# Altium project FIoT_BG96.PrjPcb
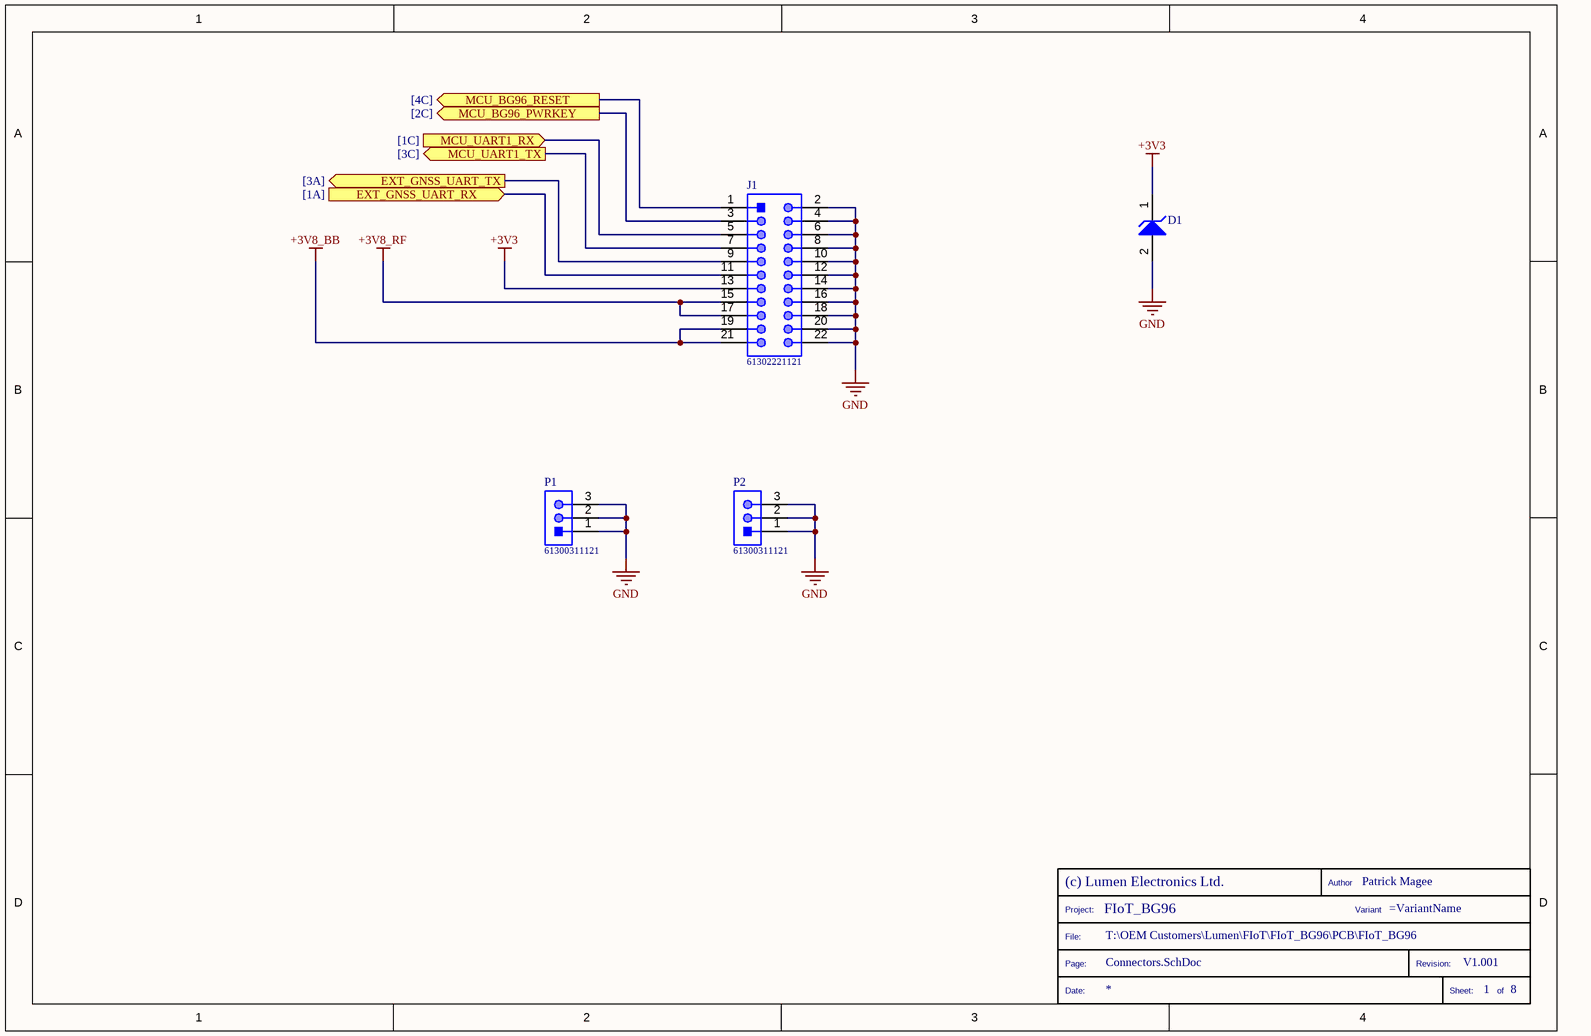
[diagram p0: Connectors.SchDoc]
VersionRevision: V1.001; ProjectAuthor: Patrick Magee; Project: FIoT_BG96; FilePath: T:\OEM Customers\Lumen\FIoT\FIoT_BG96\PCB\FIoT_BG96; Company: (c) Lumen Electronics Ltd.
8 sheets, 76 parts. Net scope: flat (ports and power ports of the same name join across sheets).
Board file: FIoT_BG96.PcbDoc
Sheets:
  Connectors.SchDoc
  UART_Level_Shift.SchDoc
  BG96.SchDoc
  Debug_USB.SchDoc
  Power.SchDoc
  MMF2.SchDoc
  Interface.SchDoc
  Status_Net_LEDs.SchDoc

## Sheet Connectors.SchDoc: FIoT Rev 2.0
size A4; ApprovedBy: Patrick Magee; CheckedBy: Patrick Magee; Author: Patrick Magee; DrawnBy: Patrick Magee; Engineer: Patrick Magee; Organization: Lumen Electronics; DocumentNumber: 18072022 - 1; Revision: 0; SheetNumber: 1; SheetTotal: 8; ENG_APP_DATE: --/--/--; DSN_APP_DATE: --/--/--; CHK_APP_DATE: --/--/--; REV: 1.1

### Parts
*  TitleBlock  (value not drawn)  (graphical)
D1  ESD9X3.3ST5G  [ONSC-SOD-923-2-514AA-01_V]  (value not drawn)
J1  61302221121  [61302221121]
P1  61300311121  [61300311121]
P2  61300311121  [61300311121]

### Ports
EXT_GNSS_UART_RX (in, see [1A]), EXT_GNSS_UART_TX (out, see [3A]), MCU_BG96_PWRKEY (out, see [2C]), MCU_BG96_RESET (out, see [4C]), MCU_UART1_RX (in, see [1C]), MCU_UART1_TX (out, see [3C])

### Nets
+3V3: D1.1(K) J1.13
+3V8_BB: J1.19 J1.21
+3V8_RF: J1.15 J1.17
GND: D1.2(A) J1.2 J1.4 J1.6 J1.8 J1.10 J1.12 J1.14 J1.16 J1.18 J1.20 J1.22 P1.1 P1.2 P1.3 P2.1 P2.2 P2.3
EXT_GNSS_UART_RX: J1.11 ; port EXT_GNSS_UART_RX
EXT_GNSS_UART_TX: J1.9 ; port EXT_GNSS_UART_TX
MCU_BG96_PWRKEY: J1.3 ; port MCU_BG96_PWRKEY
MCU_BG96_RESET: J1.1 ; port MCU_BG96_RESET
MCU_UART1_RX: J1.5 ; port MCU_UART1_RX
MCU_UART1_TX: J1.7 ; port MCU_UART1_TX

### Notes on the sheet
- DWG. NO.
- REV.
- SHT.
- THIS DOCUMENT AND THE DATA DISCLOSED HEREIN OR HEREWITH IS THE PROPERTY OF ALTIUM LIMITED AND MAY BE FREELY DISTRIBUTED IN WHOLE. NO RIGHTS ARE RESERVED OR EXPRESS OR IMPLIED WARANTEE GIVEN.
- REVISION
- DESCRIPTION
- DATE
- APPROVED
- ENG:
- APPROVALS
- PROJECT
- DSN:
- CHK:
- REFERENCE DOCUMENTS
- PROJECT REVISION:
- TITLE
- DOCUMENT REVISION:
- DESIGN ITEM:
- BOM:
- FAB DWG:
- PCB DWG:
- ASSY DWG:
- SCALE:
- SIZE
- B
- CAGE CODE
- FILE NAME
- DWG NO.
- SHEET
- OF
- REV
- (in symbol TitleBlock) Author; Project:; Variant; File:; Page:; Revision:; Date:; Sheet:; of

### Library data of the parts
D1 = LPN00013: Transient Voltage Suppressor, Micro-Packaged Diode for ESD Protection, 2-Pin SOD-923, Pb-Free, Tape and Reel; Manufacturer 1: On Semiconductor; Manufacturer Part Number 1: ESD9X3.3ST5G; Supplier 1: Farnell; Supplier Part Number 1: 2627963; Lumen Part Number: LPN00013
J1 = LPN00011: THT Vertical Pin Header WR-PHD, Pitch 2.54 mm, Dual Row, 22 pins; Manufacturer 1: Wurth Elektronik; Manufacturer Part Number 1: 61302221121; Lumen Part Number: LPN00011
P1 P2 = LPN00010: THT Vertical Pin Header WR-PHD, Pitch 2.54 mm, Single Row, 3 pins; Manufacturer 1: Wurth Elektronik; Manufacturer Part Number 1: 61300311121; Lumen Part Number: LPN00010

## Sheet UART_Level_Shift.SchDoc: FIoT Rev 2.0
size A4; ApprovedBy: PM; CheckedBy: PM; Author: PM; CompanyName: -; DrawnBy: PM; Engineer: AG; DocumentNumber: 18072022 - 1; Revision: 0; SheetNumber: 2; SheetTotal: 8; CHK_APP_DATE: --/--/--
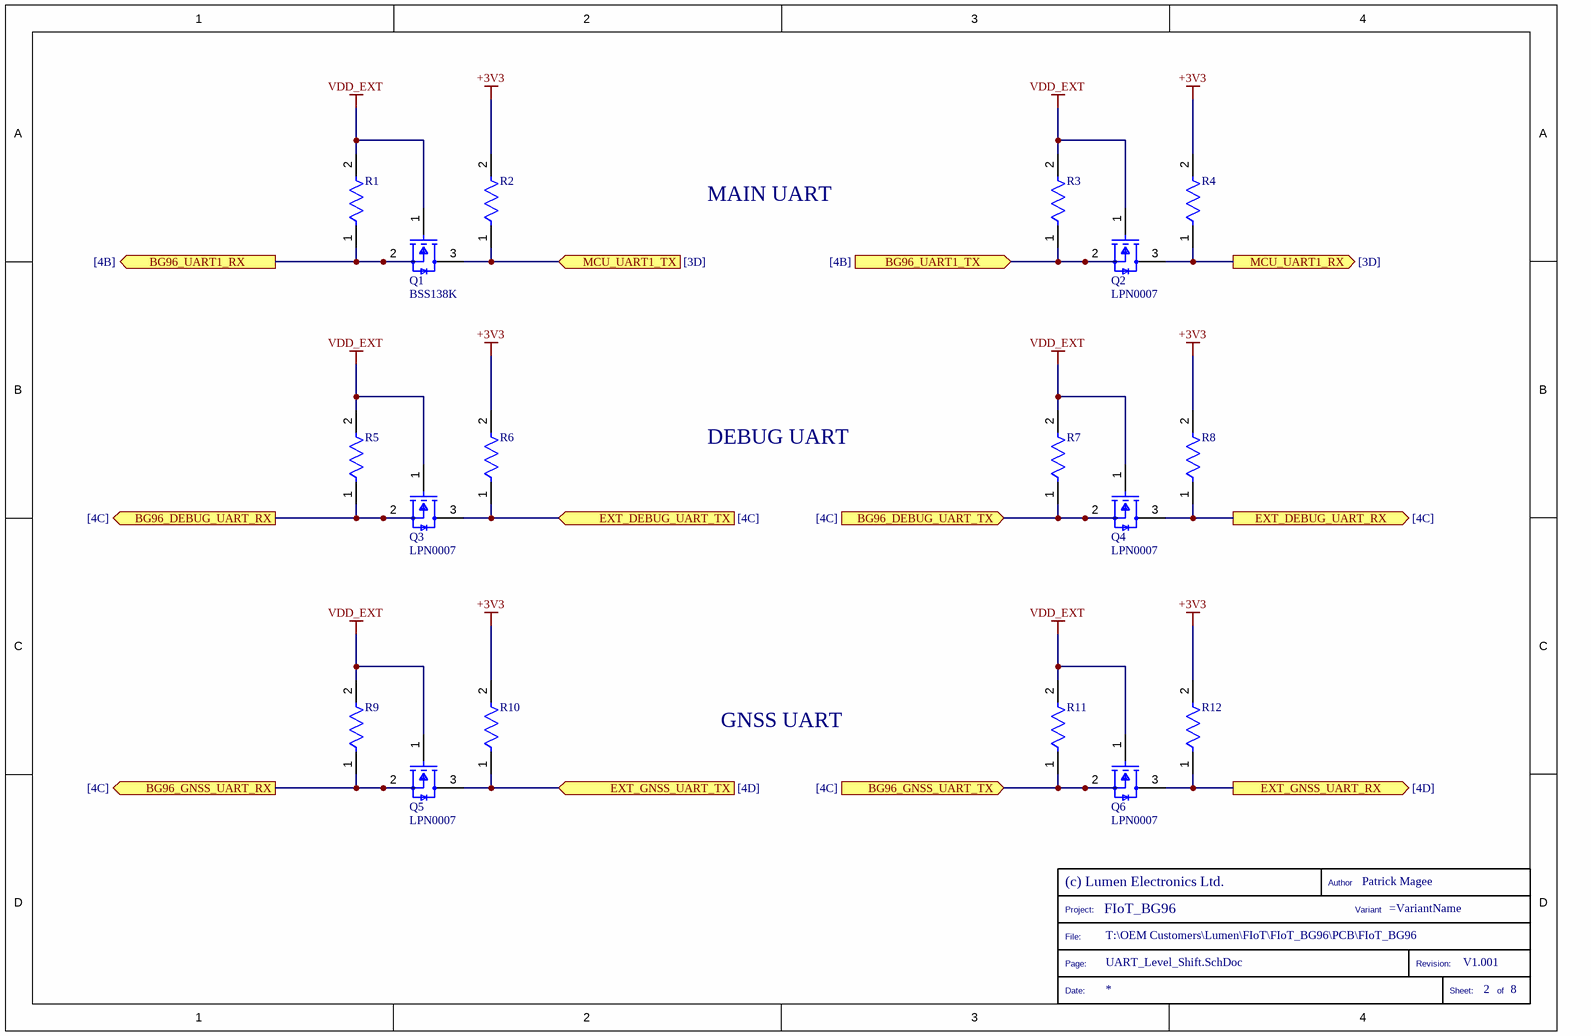
[diagram p1: UART_Level_Shift.SchDoc]

### Parts
(Parts that share a designator on the sheet are numbered #1, #2 ... from top to bottom, then left to right.)
*?#1  TitleBlock  (value not drawn)  (graphical)
Q1  BSS138K  [FP-318-08-IPC_B]
Q2  LPN0007  [FP-318-08-IPC_B]
Q3  LPN0007  [FP-318-08-IPC_B]
Q4  LPN0007  [FP-318-08-IPC_B]
Q5  LPN0007  [FP-318-08-IPC_B]
Q6  LPN0007  [FP-318-08-IPC_B]
R1  0402WGF1002TCE  [FP-CRCW0402-e3-MFG]  (value not drawn)
R2  0402WGF1002TCE  [FP-CRCW0402-e3-MFG]  (value not drawn)
R3  0402WGF1002TCE  [FP-CRCW0402-e3-MFG]  (value not drawn)
R4  0402WGF1002TCE  [FP-CRCW0402-e3-MFG]  (value not drawn)
R5  0402WGF1002TCE  [FP-CRCW0402-e3-MFG]  (value not drawn)
R6  0402WGF1002TCE  [FP-CRCW0402-e3-MFG]  (value not drawn)
R7  0402WGF1002TCE  [FP-CRCW0402-e3-MFG]  (value not drawn)
R8  0402WGF1002TCE  [FP-CRCW0402-e3-MFG]  (value not drawn)
R9  0402WGF1002TCE  [FP-CRCW0402-e3-MFG]  (value not drawn)
R10  0402WGF1002TCE  [FP-CRCW0402-e3-MFG]  (value not drawn)
R11  0402WGF1002TCE  [FP-CRCW0402-e3-MFG]  (value not drawn)
R12  0402WGF1002TCE  [FP-CRCW0402-e3-MFG]  (value not drawn)

### Ports
BG96_DEBUG_UART_RX (out, see [4C]), BG96_DEBUG_UART_TX (in, see [4C]), BG96_GNSS_UART_RX (out, see [4C]), BG96_GNSS_UART_TX (in, see [4C]), BG96_UART1_RX (out, see [4B]), BG96_UART1_TX (in, see [4B]), EXT_DEBUG_UART_RX (out, see [4C]), EXT_DEBUG_UART_TX (in, see [4C]), EXT_GNSS_UART_RX (out, see [4D]), EXT_GNSS_UART_TX (in, see [4D]), MCU_UART1_RX (out, see [3D]), MCU_UART1_TX (in, see [3D])

### Nets
+3V3: R2.2 R4.2 R6.2 R8.2 R10.2 R12.2
VDD_EXT: Q1.1(G) Q2.1(G) Q3.1(G) Q4.1(G) Q5.1(G) Q6.1(G) R1.2 R3.2 R5.2 R7.2 R9.2 R11.2
BG96_DEBUG_UART_RX: Q3.2(S) R5.1 ; port BG96_DEBUG_UART_RX
BG96_DEBUG_UART_TX: Q4.2(S) R7.1 ; port BG96_DEBUG_UART_TX
BG96_GNSS_UART_RX: Q5.2(S) R9.1 ; port BG96_GNSS_UART_RX
BG96_GNSS_UART_TX: Q6.2(S) R11.1 ; port BG96_GNSS_UART_TX
BG96_UART1_RX: Q1.2(S) R1.1 ; port BG96_UART1_RX
BG96_UART1_TX: Q2.2(S) R3.1 ; port BG96_UART1_TX
EXT_DEBUG_UART_RX: Q4.3(D) R8.1 ; port EXT_DEBUG_UART_RX
EXT_DEBUG_UART_TX: Q3.3(D) R6.1 ; port EXT_DEBUG_UART_TX
EXT_GNSS_UART_RX: Q6.3(D) R12.1 ; port EXT_GNSS_UART_RX
EXT_GNSS_UART_TX: Q5.3(D) R10.1 ; port EXT_GNSS_UART_TX
MCU_UART1_RX: Q2.3(D) R4.1 ; port MCU_UART1_RX
MCU_UART1_TX: Q1.3(D) R2.1 ; port MCU_UART1_TX

### Notes on the sheet
- MAIN UART
- DEBUG UART
- GNSS UART
- DWG. NO.
- REV.
- SHT.
- THIS DOCUMENT AND THE DATA DISCLOSED HEREIN OR HEREWITH IS THE PROPERTY OF ALTIUM LIMITED AND MAY BE FREELY DISTRIBUTED IN WHOLE. NO RIGHTS ARE RESERVED OR EXPRESS OR IMPLIED WARANTEE GIVEN.
- REVISION
- DESCRIPTION
- DATE
- APPROVED
- ENG:
- APPROVALS
- PROJECT
- DSN:
- CHK:
- REFERENCE DOCUMENTS
- PROJECT REVISION:
- TITLE
- DOCUMENT REVISION:
- DESIGN ITEM:
- BOM:
- FAB DWG:
- PCB DWG:
- ASSY DWG:
- SCALE:
- SIZE
- B
- CAGE CODE
- FILE NAME
- DWG NO.
- SHEET
- OF
- REV
- (in symbol TitleBlock) Author; Project:; Variant; File:; Page:; Revision:; Date:; Sheet:; of

### Library data of the parts
Q1-Q6 = LPN0007: MOSFET N-CH 50V 220MA SOT-23; Manufacturer 1: ON Semiconductor / Fairchild; Manufacturer Part Number 1: BSS138; Supplier 1: Digi-Key; Supplier Part Number 1: BSS138K-13DICT-ND; Lumen Part Number: LPN0007
R1-R12 = LPN0003: Res Thick Film 0402 10K Ohm 1% 0.063W; Manufacturer 1: Vishay Dale; Manufacturer Part Number 1: CRCW04021K00FKED; Supplier 1: Mouser; Supplier Part Number 1: 303-0402WGF1002TCE; Lumen Part Number: LPN0003

## Sheet BG96.SchDoc: FIoT Rev 2.0
size A4; ApprovedBy: PM; CheckedBy: PM; Author: AG; CompanyName: -; DrawnBy: AG; Engineer: AG; DocumentNumber: 18072022 - 1; Revision: 0; SheetNumber: 3; SheetTotal: 8; ENG_APP_DATE: --/--/--; DSN_APP_DATE: --/--/--; CHK_APP_DATE: --/--/--
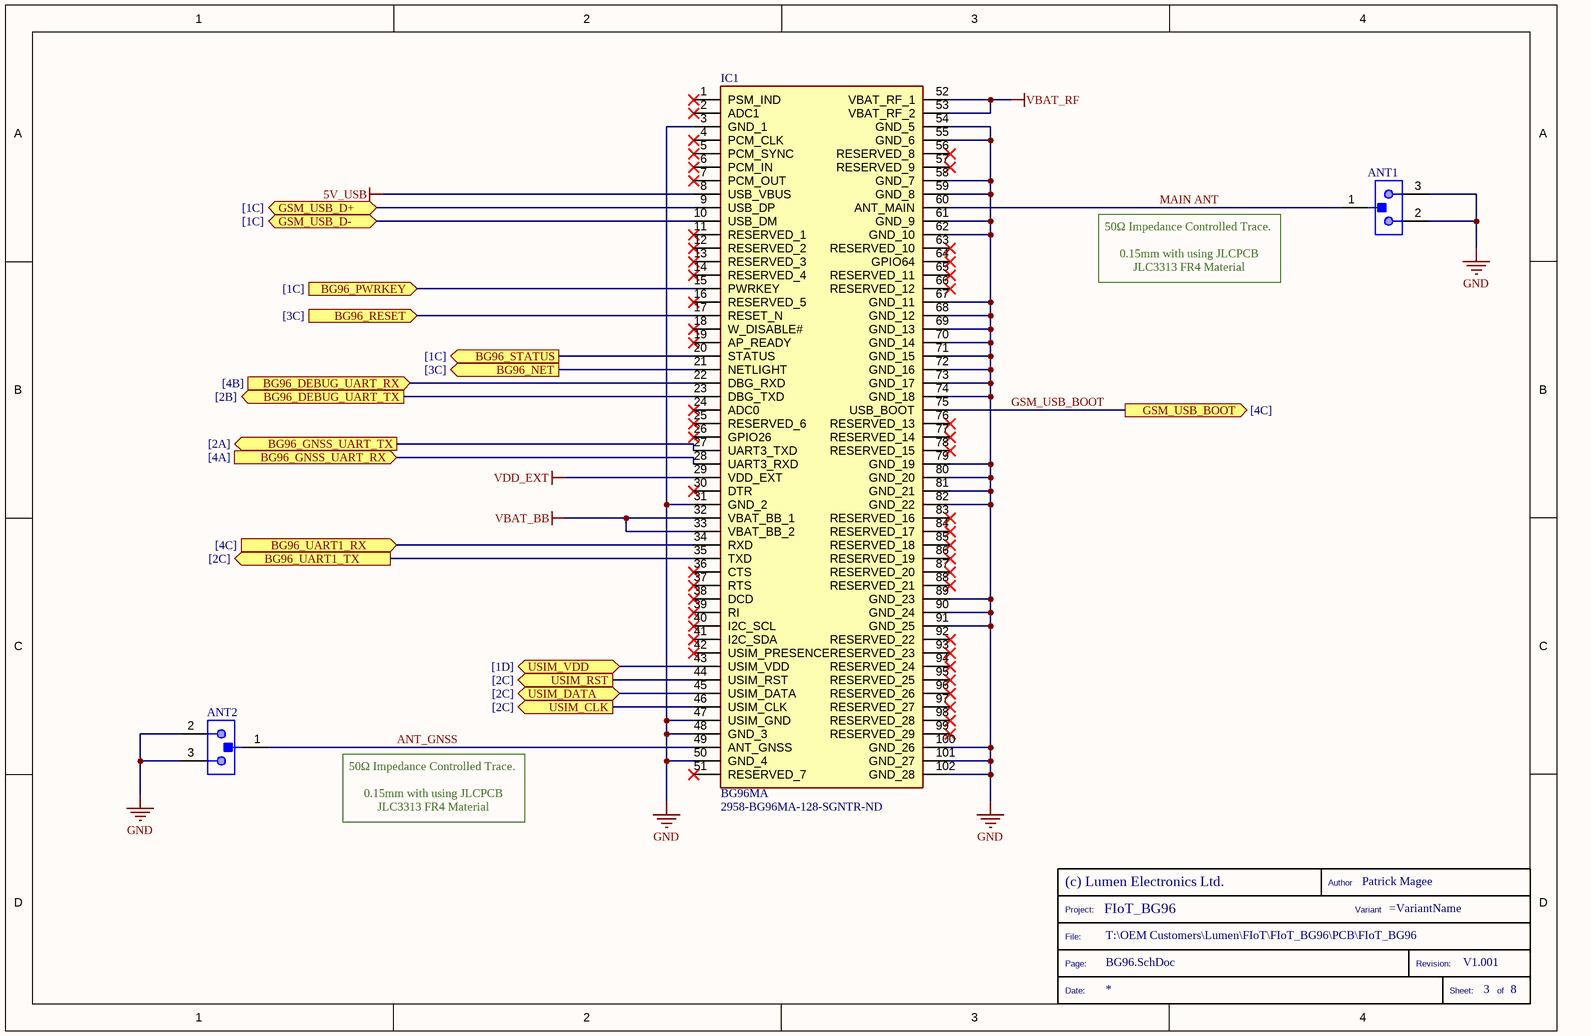
[diagram p2: BG96.SchDoc]

### Parts
(Parts that share a designator on the sheet are numbered #1, #2 ... from top to bottom, then left to right.)
*?#2  TitleBlock  (value not drawn)  (graphical)
ANT1  U.FL-R-SMT(01)  [HRS-U.FL-R-SMT(10)_V]  (value not drawn)
ANT2  U.FL-R-SMT(01)  [HRS-U.FL-R-SMT(10)_V]  (value not drawn)
IC1  BG96MA  Supplier Part Number 1: 2958-BG96MA-128-SGNTR-ND  [BG96MA]

### Ports
BG96_DEBUG_UART_RX (in, see [4B]), BG96_DEBUG_UART_TX (out, see [2B]), BG96_GNSS_UART_RX (in, see [4A]), BG96_GNSS_UART_TX (out, see [2A]), BG96_NET (out, see [3C]), BG96_PWRKEY (in, see [1C]), BG96_RESET (in, see [3C]), BG96_STATUS (out, see [1C]), BG96_UART1_RX (in, see [4C]), BG96_UART1_TX (out, see [2C]), GSM_USB_BOOT (out, see [4C]), GSM_USB_D+ (bidir, see [1C]), GSM_USB_D- (bidir, see [1C]), USIM_CLK (out, see [2C]), USIM_DATA (bidir, see [2C]), USIM_RST (out, see [2C]), USIM_VDD (bidir, see [1D])

### Nets
5V_USB: IC1.8(USB_VBUS)
GND: ANT1.2 ANT1.3 ANT2.2 ANT2.3 IC1.3(GND_1) IC1.31(GND_2) IC1.47(USIM_GND) IC1.48(GND_3) IC1.50(GND_4) IC1.54(GND_5) IC1.55(GND_6) IC1.58(GND_7) IC1.59(GND_8) IC1.61(GND_9) IC1.62(GND_10) IC1.67(GND_11) IC1.68(GND_12) IC1.69(GND_13) IC1.70(GND_14) IC1.71(GND_15) IC1.72(GND_16) IC1.73(GND_17) IC1.74(GND_18) IC1.79(GND_19) IC1.80(GND_20) IC1.81(GND_21) IC1.82(GND_22) IC1.89(GND_23) IC1.90(GND_24) IC1.91(GND_25) IC1.100(GND_26) IC1.101(GND_27) IC1.102(GND_28)
VBAT_BB: IC1.32(VBAT_BB_1) IC1.33(VBAT_BB_2)  [project net +3V8_BB]
VBAT_RF: IC1.52(VBAT_RF_1) IC1.53(VBAT_RF_2)  [project net +3V8_RF]
VDD_EXT: IC1.29(VDD_EXT)
ANT_GNSS: ANT2.1 IC1.49(ANT_GNSS)
BG96_DEBUG_UART_RX: IC1.22(DBG_RXD) ; port BG96_DEBUG_UART_RX
BG96_DEBUG_UART_TX: IC1.23(DBG_TXD) ; port BG96_DEBUG_UART_TX
BG96_GNSS_UART_RX: IC1.28(UART3_RXD) ; port BG96_GNSS_UART_RX
BG96_GNSS_UART_TX: IC1.27(UART3_TXD) ; port BG96_GNSS_UART_TX
BG96_NET: IC1.21(NETLIGHT) ; port BG96_NET
BG96_PWRKEY: IC1.15(PWRKEY) ; port BG96_PWRKEY
BG96_RESET: IC1.17(RESET_N) ; port BG96_RESET
BG96_STATUS: IC1.20(STATUS) ; port BG96_STATUS
BG96_UART1_RX: IC1.34(RXD) ; port BG96_UART1_RX
BG96_UART1_TX: IC1.35(TXD) ; port BG96_UART1_TX
GSM_USB_BOOT: IC1.75(USB_BOOT) ; port GSM_USB_BOOT
GSM_USB_D+: IC1.9(USB_DP) ; port GSM_USB_D+
GSM_USB_D-: IC1.10(USB_DM) ; port GSM_USB_D-
MAIN ANT: ANT1.1 IC1.60(ANT_MAIN)
USIM_CLK: IC1.46(USIM_CLK) ; port USIM_CLK
USIM_DATA: IC1.45(USIM_DATA) ; port USIM_DATA
USIM_RST: IC1.44(USIM_RST) ; port USIM_RST
USIM_VDD: IC1.43(USIM_VDD) ; port USIM_VDD

Not connected (* = marked no-connect by the designer): IC1 1(PSM_IND)* 2(ADC1)* 4(PCM_CLK)* 5(PCM_SYNC)* 6(PCM_IN)* 7(PCM_OUT)* 11(RESERVED_1)* 12(RESERVED_2)* 13(RESERVED_3)* 14(RESERVED_4)* 16(RESERVED_5)* 18(W_DISABLE#)* 19(AP_READY)* 24(ADC0)* 25(RESERVED_6)* 26(GPIO26)* 30(DTR)* 36(CTS)* 37(RTS)* 38(DCD)* 39(RI)* 40(I2C_SCL)* 41(I2C_SDA)* 42(USIM_PRESENCE)* 51(RESERVED_7)* 56(RESERVED_8)* 57(RESERVED_9)* 63(RESERVED_10)* 64(GPIO64)* 65(RESERVED_11)* 66(RESERVED_12)* 76(RESERVED_13)* 77(RESERVED_14)* 78(RESERVED_15)* 83(RESERVED_16)* 84(RESERVED_17)* 85(RESERVED_18)* 86(RESERVED_19)* 87(RESERVED_20)* 88(RESERVED_21)* 92(RESERVED_22)* 93(RESERVED_23)* 94(RESERVED_24)* 95(RESERVED_25)* 96(RESERVED_26)* 97(RESERVED_27)* 98(RESERVED_28)* 99(RESERVED_29)*

### Notes on the sheet
- 50Ω Impedance Controlled Trace.
  0.15mm with using JLCPCB JLC3313 FR4 Material
- DWG. NO.
- REV.
- SHT.
- THIS DOCUMENT AND THE DATA DISCLOSED HEREIN OR HEREWITH IS THE PROPERTY OF ALTIUM LIMITED AND MAY BE FREELY DISTRIBUTED IN WHOLE. NO RIGHTS ARE RESERVED OR EXPRESS OR IMPLIED WARANTEE GIVEN.
- REVISION
- DESCRIPTION
- DATE
- APPROVED
- ENG:
- APPROVALS
- PROJECT
- DSN:
- CHK:
- REFERENCE DOCUMENTS
- PROJECT REVISION:
- TITLE
- DOCUMENT REVISION:
- DESIGN ITEM:
- BOM:
- FAB DWG:
- PCB DWG:
- ASSY DWG:
- SCALE:
- SIZE
- B
- CAGE CODE
- FILE NAME
- DWG NO.
- SHEET
- OF
- REV
- (in symbol TitleBlock) Author; Project:; Variant; File:; Page:; Revision:; Date:; Sheet:; of

### Library data of the parts
ANT1 ANT2 = LPN00021: CONN RECPT ULTRA-MINI COAX SMD; Manufacturer 1: Hirose Electric; Manufacturer Part Number 1: U.FL-R-SMT(01); Supplier 1: Farnell; Supplier Part Number 1: 3908021; Lumen Part Number: LPN00021
IC1 = LPN0006: Cellular EDGE, GPRS, GSM, HSPA, LTE, UMTS Transceiver Module 850MHz, 900MHz, 1.8GHz, 1.9GHz Antenna Not Included Surface Mount; Supplier 1: Digi-Key; Lumen Part Number: LPN0006

## Sheet Debug_USB.SchDoc: FIoT Rev 2.0
size A4; ApprovedBy: PM; CheckedBy: PM; Author: AG; CompanyName: -; DrawnBy: AG; Engineer: AG; DocumentNumber: 18072022 - 1; Revision: 0; SheetNumber: 4; SheetTotal: 8; ENG_APP_DATE: --/--/--; DSN_APP_DATE: --/--/--; CHK_APP_DATE: --/--/--
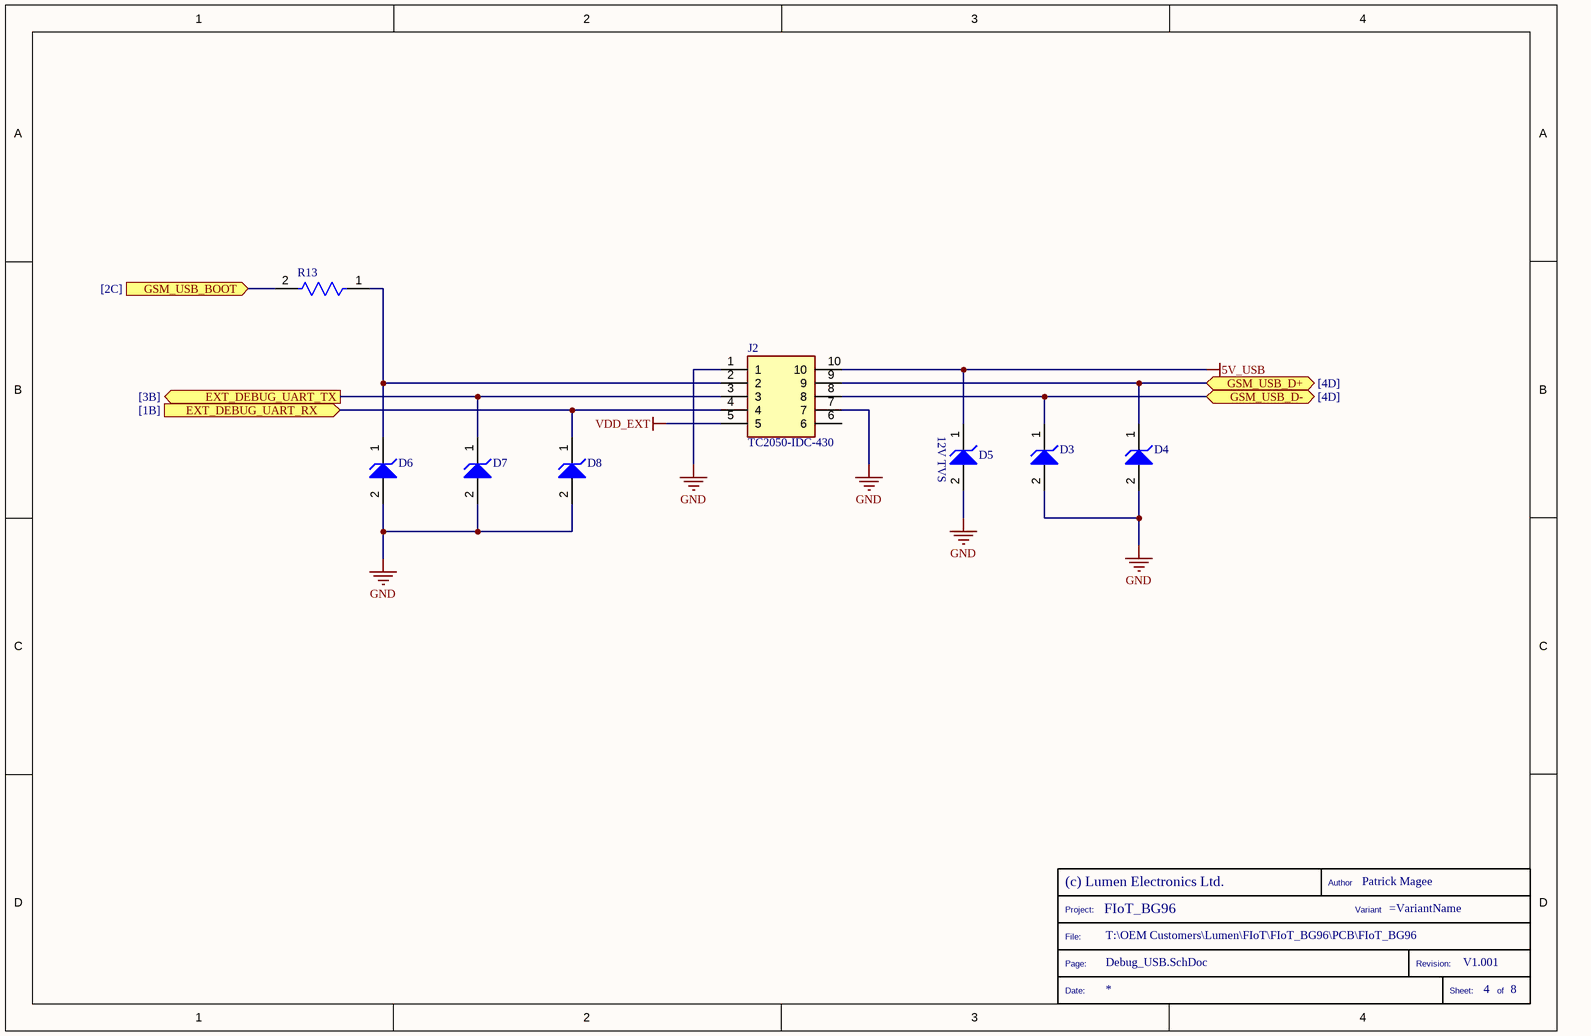
[diagram p3: Debug_USB.SchDoc]

### Parts
(Parts that share a designator on the sheet are numbered #1, #2 ... from top to bottom, then left to right.)
*?#3  TitleBlock  (value not drawn)  (graphical)
D3  ESD9L5.0ST5G  [ONSC-SOD-923-2-514AA-01_V]  (value not drawn)
D4  ESD9L5.0ST5G  [ONSC-SOD-923-2-514AA-01_V]  (value not drawn)
D5  SD12C.TCT  [CR_SD05_SEM-L]  (value not drawn)
D6  ESD9X3.3ST5G  [ONSC-SOD-923-2-514AA-01_V]  (value not drawn)
D7  ESD9X3.3ST5G  [ONSC-SOD-923-2-514AA-01_V]  (value not drawn)
D8  ESD9X3.3ST5G  [ONSC-SOD-923-2-514AA-01_V]  (value not drawn)
J2  TC2050-IDC-430  [TC2050-IDC_Lumen]  (no BOM)
R13  0402WGF1002TCE  [FP-CRCW0402-e3-MFG]  (value not drawn)

### Ports
EXT_DEBUG_UART_RX (in, see [1B]), EXT_DEBUG_UART_TX (out, see [3B]), GSM_USB_BOOT (in, see [2C]), GSM_USB_D+ (bidir, see [4D]), GSM_USB_D- (bidir, see [4D])

### Nets
5V_USB: D5.1(K) J2.10
GND: D3.2(A) D4.2(A) D5.2(A) D6.2(A) D7.2(A) D8.2(A) J2.1 J2.7
VDD_EXT: J2.5
EXT_DEBUG_UART_RX: D8.1(K) J2.4 ; port EXT_DEBUG_UART_RX
EXT_DEBUG_UART_TX: D7.1(K) J2.3 ; port EXT_DEBUG_UART_TX
GSM_USB_BOOT: R13.2 ; port GSM_USB_BOOT
GSM_USB_D+: D4.1(K) J2.9 ; port GSM_USB_D+
GSM_USB_D-: D3.1(K) J2.8 ; port GSM_USB_D-
NetD6_1: D6.1(K) J2.2 R13.1

Not connected (* = marked no-connect by the designer): J2 6

### Notes on the sheet
- DWG. NO.
- REV.
- SHT.
- THIS DOCUMENT AND THE DATA DISCLOSED HEREIN OR HEREWITH IS THE PROPERTY OF ALTIUM LIMITED AND MAY BE FREELY DISTRIBUTED IN WHOLE. NO RIGHTS ARE RESERVED OR EXPRESS OR IMPLIED WARANTEE GIVEN.
- REVISION
- DESCRIPTION
- DATE
- APPROVED
- ENG:
- APPROVALS
- PROJECT
- DSN:
- CHK:
- REFERENCE DOCUMENTS
- PROJECT REVISION:
- TITLE
- DOCUMENT REVISION:
- DESIGN ITEM:
- BOM:
- FAB DWG:
- PCB DWG:
- ASSY DWG:
- SCALE:
- SIZE
- B
- CAGE CODE
- FILE NAME
- DWG NO.
- SHEET
- OF
- REV
- (in symbol LPN00017) 12V TVS
- (in symbol TitleBlock) Author; Project:; Variant; File:; Page:; Revision:; Date:; Sheet:; of

### Library data of the parts
D3 D4 = LPN00012: Transient Voltage Suppressor, ESD Protection Diode with Ultra-Low Capacitance, 2-Pin SOD-923, Pb-Free, Tape and Reel; Manufacturer 1: ON Semiconductor; Manufacturer Part Number 1: ESD9L5.0ST5G; Supplier 1: Digi-Key; Supplier Part Number 1: ESD9L5.0ST5GOSCT-ND; Lumen Part Number: LPN00012
D5 = LPN00017: TVS DIODE 12VWM 24VC SOD323; Supplier 1: Digi-Key; Supplier Part Number 1: SD12C.TCTCT-ND; Lumen Part Number: LPN00017
D6-D8 = LPN00013: as D1 on sheet Connectors; Manufacturer Part Number 1: ESD9X3.3ST5G; Supplier 1: Farnell; Supplier Part Number 1: 2627963; Lumen Part Number: LPN00013
J2 = LPN00019: Connector; Lumen Part Number: LPN00019
R13 = LPN0003: as R1 on sheet UART_Level_Shift; Supplier 1: Mouser; Supplier Part Number 1: 303-0402WGF1002TCE; Lumen Part Number: LPN0003

## Sheet Power.SchDoc: FIoT Rev 2.0
size A4; ApprovedBy: PM; CheckedBy: PM; Author: AG; CompanyName: -; DrawnBy: AG; Engineer: AG; DocumentNumber: 18072022 - 1; Revision: 0; SheetNumber: 5; SheetTotal: 8; ENG_APP_DATE: --/--/--; DSN_APP_DATE: --/--/--; CHK_APP_DATE: --/--/--
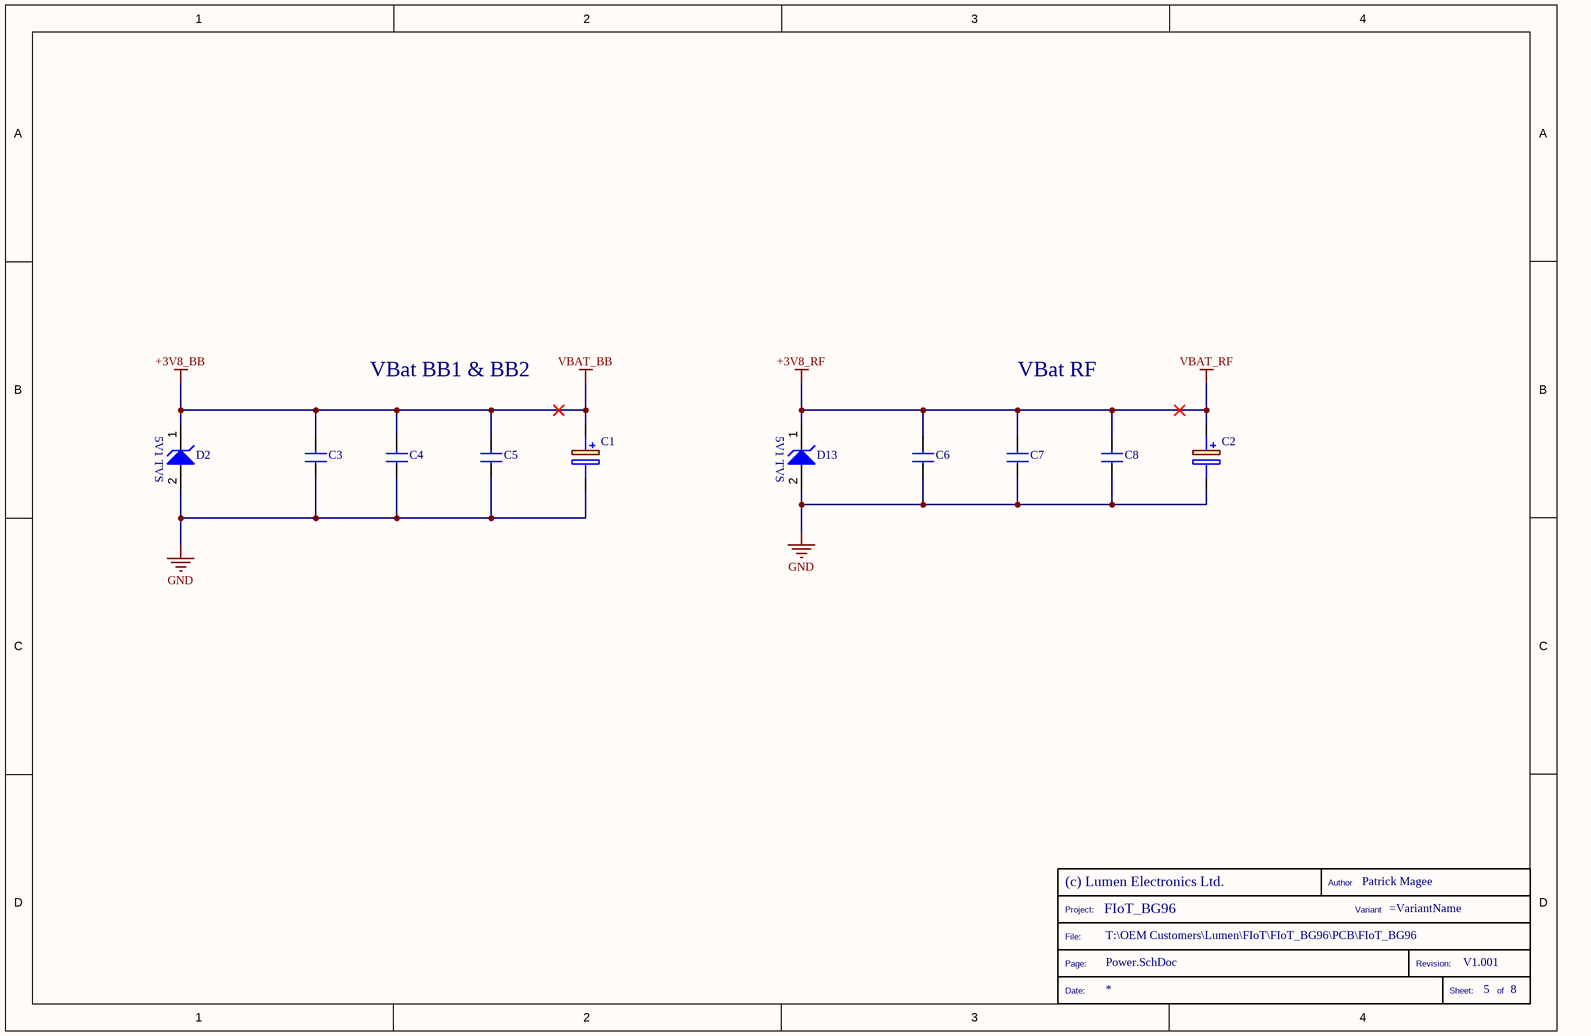
[diagram p4: Power.SchDoc]

### Parts
(Parts that share a designator on the sheet are numbered #1, #2 ... from top to bottom, then left to right.)
*?#4  TitleBlock  (value not drawn)  (graphical)
C1  T520A107M006ATE035  [CAPPM3216X180N]  (value not drawn)
C2  T520A107M006ATE035  [CAPPM3216X180N]  (value not drawn)
C3  GRM1555C1H6R0CA01D  [CAPC1005X06N]  (value not drawn)
C4  GJM1555C1H330GB01D  [CAPC1005X06N]  (value not drawn)
C5  CL05B104KB54PNC  [CAPC1005X06N]  (value not drawn)
C6  GRM1555C1H6R0CA01D  [CAPC1005X06N]  (value not drawn)
C7  GJM1555C1H330GB01D  [CAPC1005X06N]  (value not drawn)
C8  CL05B104KB54PNC  [CAPC1005X06N]  (value not drawn)
D2  PZ3D4V2H  [CR_SD05_SEM-L]  (value not drawn)
D13  PZ3D4V2H  [CR_SD05_SEM-L]  (value not drawn)

### Nets
+3V8_BB: C1.1(+) C3.2 C4.2 C5.2 D2.1(K)  [also labelled VBAT_BB]
+3V8_RF: C2.1(+) C6.2 C7.2 C8.2 D13.1(K)  [also labelled VBAT_RF]
GND: C1.2(-) C2.2(-) C3.1 C4.1 C5.1 C6.1 C7.1 C8.1 D2.2(A) D13.2(A)

### Notes on the sheet
- VBat BB1 & BB2
- VBat RF
- DWG. NO.
- REV.
- SHT.
- THIS DOCUMENT AND THE DATA DISCLOSED HEREIN OR HEREWITH IS THE PROPERTY OF ALTIUM LIMITED AND MAY BE FREELY DISTRIBUTED IN WHOLE. NO RIGHTS ARE RESERVED OR EXPRESS OR IMPLIED WARANTEE GIVEN.
- REVISION
- DESCRIPTION
- DATE
- APPROVED
- ENG:
- APPROVALS
- PROJECT
- DSN:
- CHK:
- REFERENCE DOCUMENTS
- PROJECT REVISION:
- TITLE
- DOCUMENT REVISION:
- DESIGN ITEM:
- BOM:
- FAB DWG:
- PCB DWG:
- ASSY DWG:
- SCALE:
- SIZE
- B
- CAGE CODE
- FILE NAME
- DWG NO.
- SHEET
- OF
- REV
- (in symbol LPN00016) 5V1 TVS
- (in symbol TitleBlock) Author; Project:; Variant; File:; Page:; Revision:; Date:; Sheet:; of

### Library data of the parts
C1 C2 = LPN00018: Tantalum Capacitors - Polymer 6.3 VDC 100uF 1206 20% ESR=35mOhms; Supplier 1: Farnell; Supplier Part Number 1: 2855176; Lumen Part Number: LPN00018
C3 C6 = LPN0008: 5.6pF 50V NP0 ±0.1pF 0402 MLCC; Manufacturer 1: TDK; Manufacturer Part Number 1: C1005C0G1H060C; Supplier 1: Digi-Key; Supplier Part Number 1: 490-8222-1-ND; Lumen Part Number: LPN0008
C4 C7 = LPN00014: 33pF 50V C0G ±2% 0402 MLCC; Manufacturer 1: TDK; Manufacturer Part Number 1: C1005C0G1H060C; Supplier 1: Farnell; Supplier Part Number 1: 3784396; Lumen Part Number: LPN00014
C5 C8 = LPN0009: 100nF 50V X7R ±10% 0402 MLCC; Manufacturer 1: TDK; Manufacturer Part Number 1: C1005C0G1H060C; Supplier 1: Digi-Key; Supplier Part Number 1: 1276-CL05B104KB54PNCCT-ND; Lumen Part Number: LPN0009
D2 D13 = LPN00016: 5uA@4.2V 55O Single 500mW 5.1V SOD-323 Zener Diodes ROHS; Lumen Part Number: LPN00016

## Sheet MMF2.SchDoc
size A4; SheetNumber: 6; SheetTotal: 8; ENG_APP_DATE: --/--/--; DSN_APP_DATE: --/--/--; CHK_APP_DATE: --/--/--
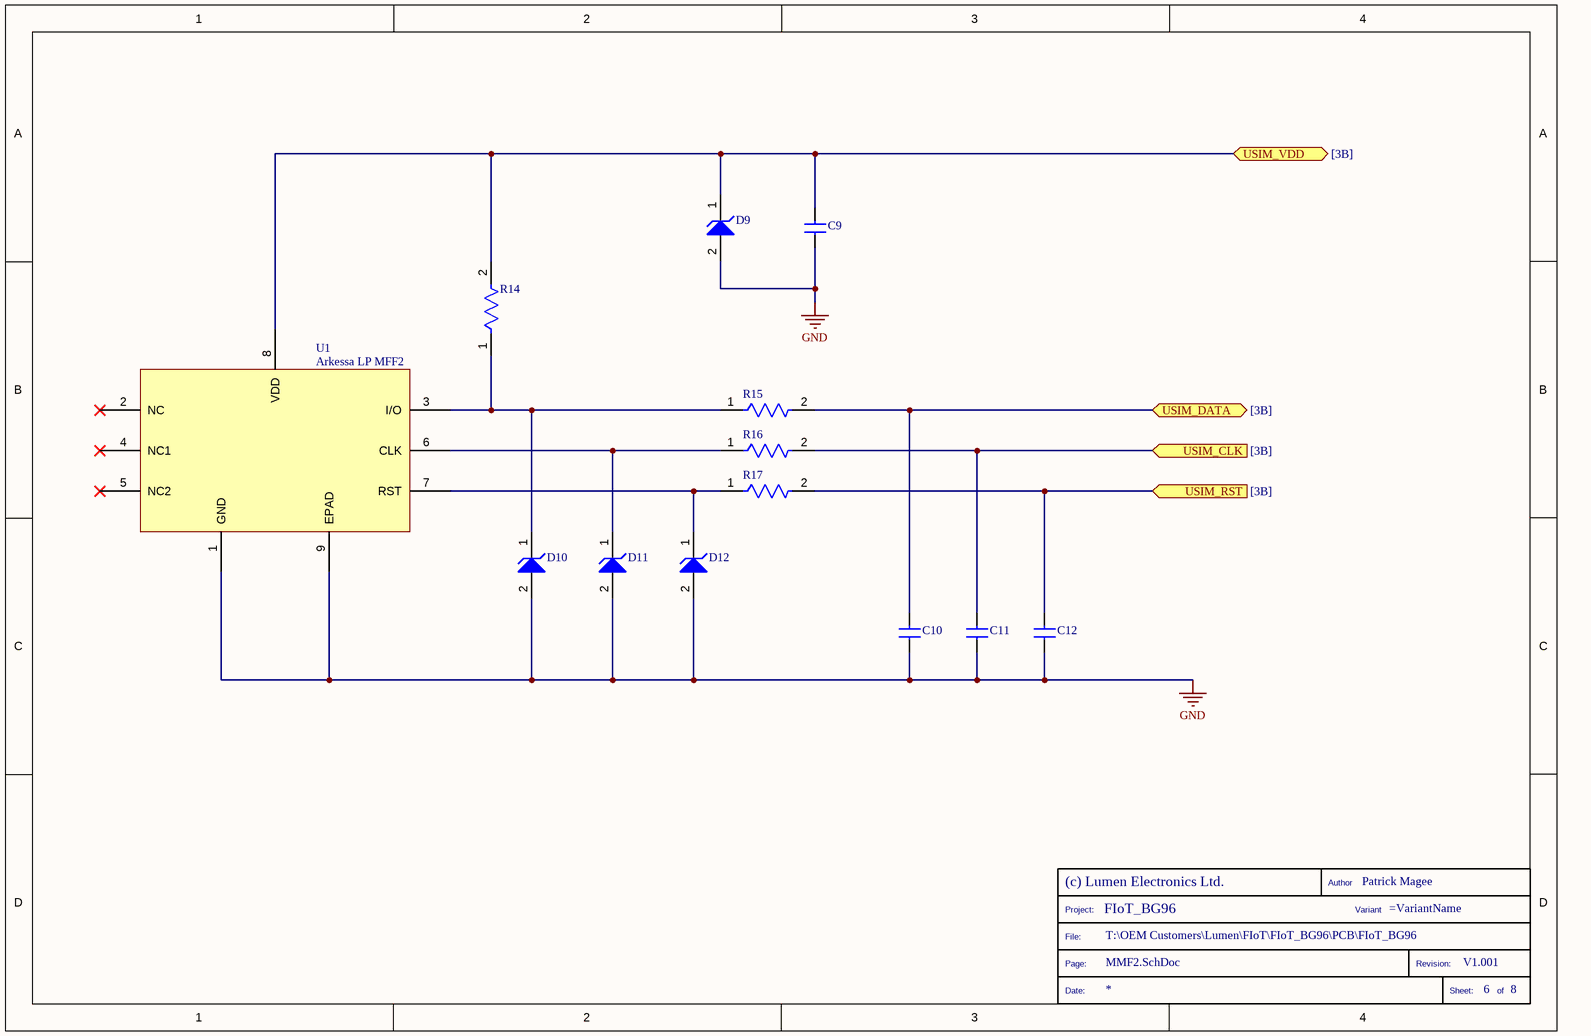
[diagram p5: MMF2.SchDoc]

### Parts
(Parts that share a designator on the sheet are numbered #1, #2 ... from top to bottom, then left to right.)
*?#5  TitleBlock  (value not drawn)  (graphical)
C9  CL05B104KB54PNC  [CAPC1005X06N]  (value not drawn)
C10  GJM1555C1H330GB01D  [CAPC1005X06N]  (value not drawn)
C11  GJM1555C1H330GB01D  [CAPC1005X06N]  (value not drawn)
C12  GJM1555C1H330GB01D  [CAPC1005X06N]  (value not drawn)
D9  ESD9L5.0ST5G  [ONSC-SOD-923-2-514AA-01_V]  (value not drawn)
D10  ESD9L5.0ST5G  [ONSC-SOD-923-2-514AA-01_V]  (value not drawn)
D11  ESD9L5.0ST5G  [ONSC-SOD-923-2-514AA-01_V]  (value not drawn)
D12  ESD9L5.0ST5G  [ONSC-SOD-923-2-514AA-01_V]  (value not drawn)
R14  0402WGF1502TCE  [FP-CRCW0402-e3-MFG]  (value not drawn)
R15  0402WGF220JTCE  [FP-CRCW0402-e3-MFG]  (value not drawn)
R16  0402WGF220JTCE  [FP-CRCW0402-e3-MFG]  (value not drawn)
R17  0402WGF220JTCE  [FP-CRCW0402-e3-MFG]  (value not drawn)
U1  Arkessa LP MFF2  [SON127P600X500X100-9N-D]

### Ports
USIM_CLK (in, see [3B]), USIM_DATA (bidir, see [3B]), USIM_RST (in, see [3B]), USIM_VDD (bidir, see [3B])

### Nets
GND: C9.1 C10.1 C11.1 C12.1 D9.2(A) D10.2(A) D11.2(A) D12.2(A) U1.1(GND) U1.9(EPAD)
USIM_CLK: C11.2 R16.2 ; port USIM_CLK
USIM_DATA: C10.2 R15.2 ; port USIM_DATA
USIM_RST: C12.2 R17.2 ; port USIM_RST
USIM_VDD: C9.2 D9.1(K) R14.2 U1.8(VDD) ; port USIM_VDD
NetD10_1: D10.1(K) R14.1 R15.1 U1.3(I/O)
NetD11_1: D11.1(K) R16.1 U1.6(CLK)
NetD12_1: D12.1(K) R17.1 U1.7(RST)

Not connected (* = marked no-connect by the designer): U1 2(NC)* 4(NC1)* 5(NC2)*

### Notes on the sheet
- DWG. NO.
- REV.
- SHT.
- THIS DOCUMENT AND THE DATA DISCLOSED HEREIN OR HEREWITH IS THE PROPERTY OF ALTIUM LIMITED AND MAY BE FREELY DISTRIBUTED IN WHOLE. NO RIGHTS ARE RESERVED OR EXPRESS OR IMPLIED WARANTEE GIVEN.
- REVISION
- DESCRIPTION
- DATE
- APPROVED
- ENG:
- APPROVALS
- PROJECT
- DSN:
- CHK:
- REFERENCE DOCUMENTS
- PROJECT REVISION:
- TITLE
- DOCUMENT REVISION:
- DESIGN ITEM:
- BOM:
- FAB DWG:
- PCB DWG:
- ASSY DWG:
- SCALE:
- SIZE
- B
- CAGE CODE
- FILE NAME
- DWG NO.
- SHEET
- OF
- REV
- (in symbol TitleBlock) Author; Project:; Variant; File:; Page:; Revision:; Date:; Sheet:; of

### Library data of the parts
C9 = LPN0009: as C5 on sheet Power; Supplier 1: Digi-Key; Supplier Part Number 1: 1276-CL05B104KB54PNCCT-ND; Lumen Part Number: LPN0009
C10-C12 = LPN00014: as C4 on sheet Power; Supplier 1: Farnell; Supplier Part Number 1: 3784396; Lumen Part Number: LPN00014
D9-D12 = LPN00012: as D3 on sheet Debug_USB; Manufacturer Part Number 1: ESD9L5.0ST5G; Supplier 1: Digi-Key; Supplier Part Number 1: ESD9L5.0ST5GOSCT-ND; Lumen Part Number: LPN00012
R14 = LPN0002: Res Thick Film 0402 15K Ohm 1% 0.063W; Manufacturer 1: Vishay Dale; Manufacturer Part Number 1: 0402WGF1502TCE; Supplier 1: Farnell; Supplier Part Number 1: 1127145; Lumen Part Number: LPN0002
R15-R17 = LPN0004: Res Thick Film 0402 22R Ohm 1% 0.063W; Manufacturer 1: Vishay Dale; Manufacturer Part Number 1: 0402WGF220JTCE; Supplier 1: Mouser; Supplier Part Number 1: 303-0402WGF220JTCE; Lumen Part Number: LPN0004
U1 = LPN0005: ESIM; Manufacturer Part Number 1: LP MFF2; Lumen Part Number: LPN0005; Manufacturer 1: Arkessa

## Sheet Interface.SchDoc
size A4; SheetNumber: 7; SheetTotal: 8; ENG_APP_DATE: --/--/--; DSN_APP_DATE: --/--/--; CHK_APP_DATE: --/--/--
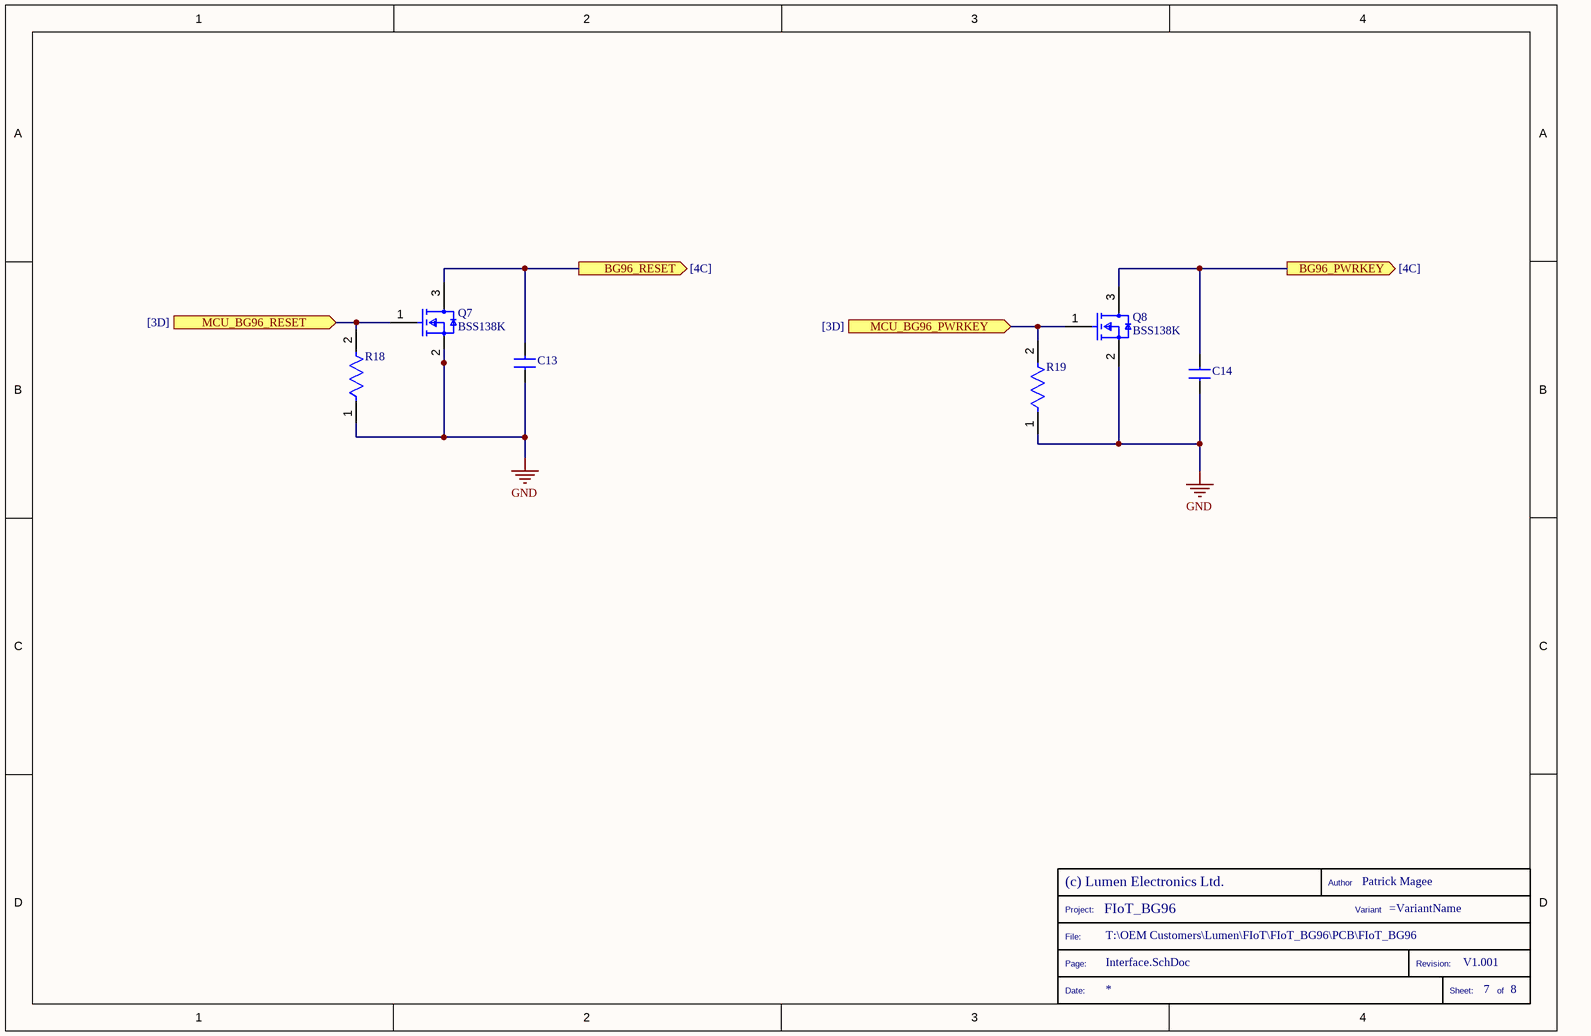
[diagram p6: Interface.SchDoc]

### Parts
(Parts that share a designator on the sheet are numbered #1, #2 ... from top to bottom, then left to right.)
*?#6  TitleBlock  (value not drawn)  (graphical)
C13  CL05B104KB54PNC  [CAPC1005X06N]  (value not drawn)
C14  CL05B104KB54PNC  [CAPC1005X06N]  (value not drawn)
Q7  BSS138K  [FP-318-08-IPC_B]
Q8  BSS138K  [FP-318-08-IPC_B]
R18  0402WGF1002TCE  [FP-CRCW0402-e3-MFG]  (value not drawn)
R19  0402WGF1002TCE  [FP-CRCW0402-e3-MFG]  (value not drawn)

### Ports
BG96_PWRKEY (out, see [4C]), BG96_RESET (out, see [4C]), MCU_BG96_PWRKEY (in, see [3D]), MCU_BG96_RESET (in, see [3D])

### Nets
GND: C13.1 C14.1 Q7.2(S) Q8.2(S) R18.1 R19.1
BG96_PWRKEY: C14.2 Q8.3(D) ; port BG96_PWRKEY
BG96_RESET: C13.2 Q7.3(D) ; port BG96_RESET
MCU_BG96_PWRKEY: Q8.1(G) R19.2 ; port MCU_BG96_PWRKEY
MCU_BG96_RESET: Q7.1(G) R18.2 ; port MCU_BG96_RESET

### Notes on the sheet
- DWG. NO.
- REV.
- SHT.
- THIS DOCUMENT AND THE DATA DISCLOSED HEREIN OR HEREWITH IS THE PROPERTY OF ALTIUM LIMITED AND MAY BE FREELY DISTRIBUTED IN WHOLE. NO RIGHTS ARE RESERVED OR EXPRESS OR IMPLIED WARANTEE GIVEN.
- REVISION
- DESCRIPTION
- DATE
- APPROVED
- ENG:
- APPROVALS
- PROJECT
- DSN:
- CHK:
- REFERENCE DOCUMENTS
- PROJECT REVISION:
- TITLE
- DOCUMENT REVISION:
- DESIGN ITEM:
- BOM:
- FAB DWG:
- PCB DWG:
- ASSY DWG:
- SCALE:
- SIZE
- B
- CAGE CODE
- FILE NAME
- DWG NO.
- SHEET
- OF
- REV
- (in symbol TitleBlock) Author; Project:; Variant; File:; Page:; Revision:; Date:; Sheet:; of

### Library data of the parts
C13 C14 = LPN0009: as C5 on sheet Power; Supplier 1: Digi-Key; Supplier Part Number 1: 1276-CL05B104KB54PNCCT-ND; Lumen Part Number: LPN0009
Q7 Q8 = LPN0007: as Q1 on sheet UART_Level_Shift; Supplier 1: Digi-Key; Supplier Part Number 1: BSS138K-13DICT-ND; Lumen Part Number: LPN0007
R18 R19 = LPN0003: as R1 on sheet UART_Level_Shift; Supplier 1: Mouser; Supplier Part Number 1: 303-0402WGF1002TCE; Lumen Part Number: LPN0003

## Sheet Status_Net_LEDs.SchDoc
size A4; SheetNumber: 8; SheetTotal: 8
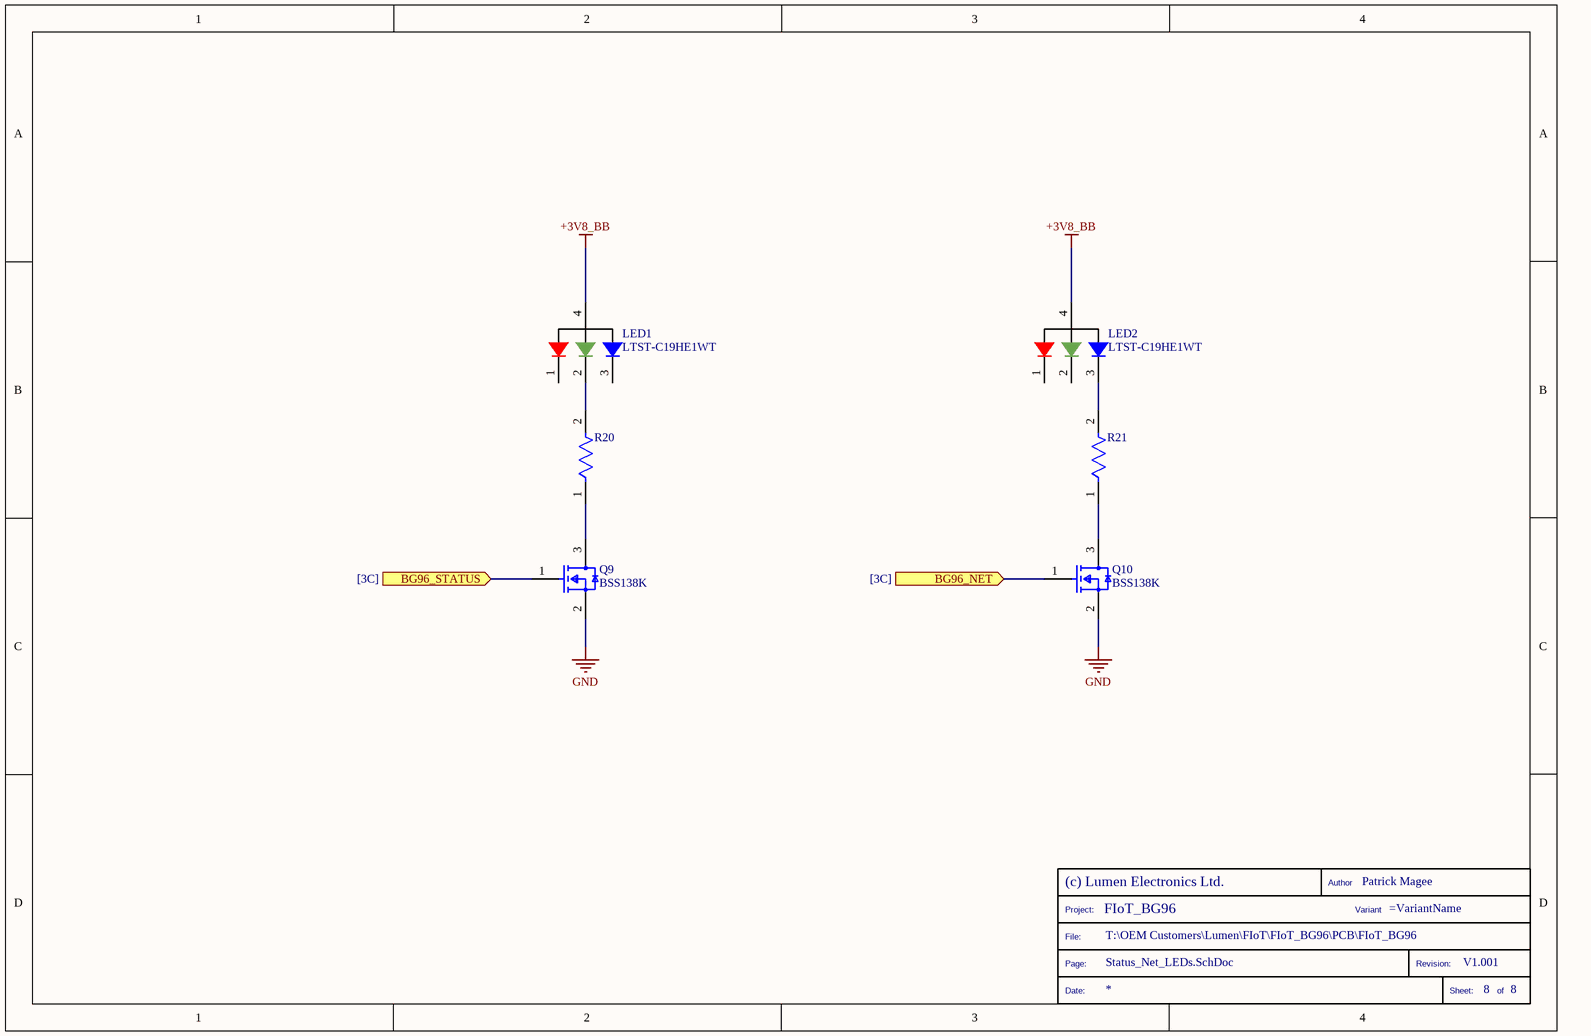
[diagram p7: Status_Net_LEDs.SchDoc]

### Parts
(Parts that share a designator on the sheet are numbered #1, #2 ... from top to bottom, then left to right.)
*?#7  TitleBlock  (value not drawn)  (graphical)
LED1  LTST-C19HE1WT  [LED_LTST-C19HE1WT]
LED2  LTST-C19HE1WT  [LED_LTST-C19HE1WT]
Q9  BSS138K  [FP-318-08-IPC_B]
Q10  BSS138K  [FP-318-08-IPC_B]
R20  0402WGF1001TCE  [FP-CRCW0402-e3-MFG]  (value not drawn)
R21  0402WGF1001TCE  [FP-CRCW0402-e3-MFG]  (value not drawn)

### Ports
BG96_NET (in, see [3C]), BG96_STATUS (in, see [3C])

### Nets
+3V8_BB: LED1.4 LED2.4
GND: Q9.2(S) Q10.2(S)
BG96_NET: Q10.1(G) ; port BG96_NET
BG96_STATUS: Q9.1(G) ; port BG96_STATUS
NetLED1_2: LED1.2 R20.2
NetLED2_3: LED2.3 R21.2
NetQ9_3: Q9.3(D) R20.1
NetQ10_3: Q10.3(D) R21.1

Not connected (* = marked no-connect by the designer): LED1 1 3; LED2 1 2

### Notes on the sheet
- (in symbol TitleBlock) Author; Project:; Variant; File:; Page:; Revision:; Date:; Sheet:; of

### Library data of the parts
LED1 LED2 = LPN00015: Red, Green, Blue _RGB_ 624nm Red, 525nm Green, 470nm Blue LED Indication - Discrete 2.1V Red, 3.35V Green, 3.35V Blue 0606 _1616 Metric_; Supplier 1: Digi-Key; Supplier Part Number 1: 160-2162-1-ND; Lumen Part Number: LPN00015
Q9 Q10 = LPN0007: as Q1 on sheet UART_Level_Shift; Supplier 1: Digi-Key; Supplier Part Number 1: BSS138K-13DICT-ND; Lumen Part Number: LPN0007
R20 R21 = LPN0001: Res Thick Film 0402 1K Ohm 1% 0.063W; Manufacturer 1: Vishay Dale; Manufacturer Part Number 1: CRCW04021K00FKED; Supplier 1: Mouser; Supplier Part Number 1: 303-0402WGF1001TCE; Lumen Part Number: LPN0001

## Nets that join several sheets
5V_USB: BG96 (IC1.8), Debug_USB (D5.1 J2.10)
+3V3: Connectors (D1.1 J1.13), UART_Level_Shift (6 pins)
+3V8_BB: Connectors (J1.19 J1.21), BG96 (IC1.32 IC1.33), Power (5 pins), Status_Net_LEDs (LED1.4 LED2.4)
+3V8_RF: Connectors (J1.15 J1.17), BG96 (IC1.52 IC1.53), Power (5 pins)
GND: Connectors (18 pins), BG96 (33 pins), Debug_USB (8 pins), Power (10 pins), MMF2 (10 pins), Interface (6 pins), Status_Net_LEDs (Q9.2 Q10.2)
VDD_EXT: UART_Level_Shift (12 pins), BG96 (IC1.29), Debug_USB (J2.5)
BG96_DEBUG_UART_RX: UART_Level_Shift (Q3.2 R5.1), BG96 (IC1.22)
BG96_DEBUG_UART_TX: UART_Level_Shift (Q4.2 R7.1), BG96 (IC1.23)
BG96_GNSS_UART_RX: UART_Level_Shift (Q5.2 R9.1), BG96 (IC1.28)
BG96_GNSS_UART_TX: UART_Level_Shift (Q6.2 R11.1), BG96 (IC1.27)
BG96_NET: BG96 (IC1.21), Status_Net_LEDs (Q10.1)
BG96_PWRKEY: BG96 (IC1.15), Interface (C14.2 Q8.3)
BG96_RESET: BG96 (IC1.17), Interface (C13.2 Q7.3)
BG96_STATUS: BG96 (IC1.20), Status_Net_LEDs (Q9.1)
BG96_UART1_RX: UART_Level_Shift (Q1.2 R1.1), BG96 (IC1.34)
BG96_UART1_TX: UART_Level_Shift (Q2.2 R3.1), BG96 (IC1.35)
EXT_DEBUG_UART_RX: UART_Level_Shift (Q4.3 R8.1), Debug_USB (D8.1 J2.4)
EXT_DEBUG_UART_TX: UART_Level_Shift (Q3.3 R6.1), Debug_USB (D7.1 J2.3)
EXT_GNSS_UART_RX: Connectors (J1.11), UART_Level_Shift (Q6.3 R12.1)
EXT_GNSS_UART_TX: Connectors (J1.9), UART_Level_Shift (Q5.3 R10.1)
GSM_USB_BOOT: BG96 (IC1.75), Debug_USB (R13.2)
GSM_USB_D+: BG96 (IC1.9), Debug_USB (D4.1 J2.9)
GSM_USB_D-: BG96 (IC1.10), Debug_USB (D3.1 J2.8)
MCU_BG96_PWRKEY: Connectors (J1.3), Interface (Q8.1 R19.2)
MCU_BG96_RESET: Connectors (J1.1), Interface (Q7.1 R18.2)
MCU_UART1_RX: Connectors (J1.5), UART_Level_Shift (Q2.3 R4.1)
MCU_UART1_TX: Connectors (J1.7), UART_Level_Shift (Q1.3 R2.1)
USIM_CLK: BG96 (IC1.46), MMF2 (C11.2 R16.2)
USIM_DATA: BG96 (IC1.45), MMF2 (C10.2 R15.2)
USIM_RST: BG96 (IC1.44), MMF2 (C12.2 R17.2)
USIM_VDD: BG96 (IC1.43), MMF2 (C9.2 D9.1 R14.2 U1.8)